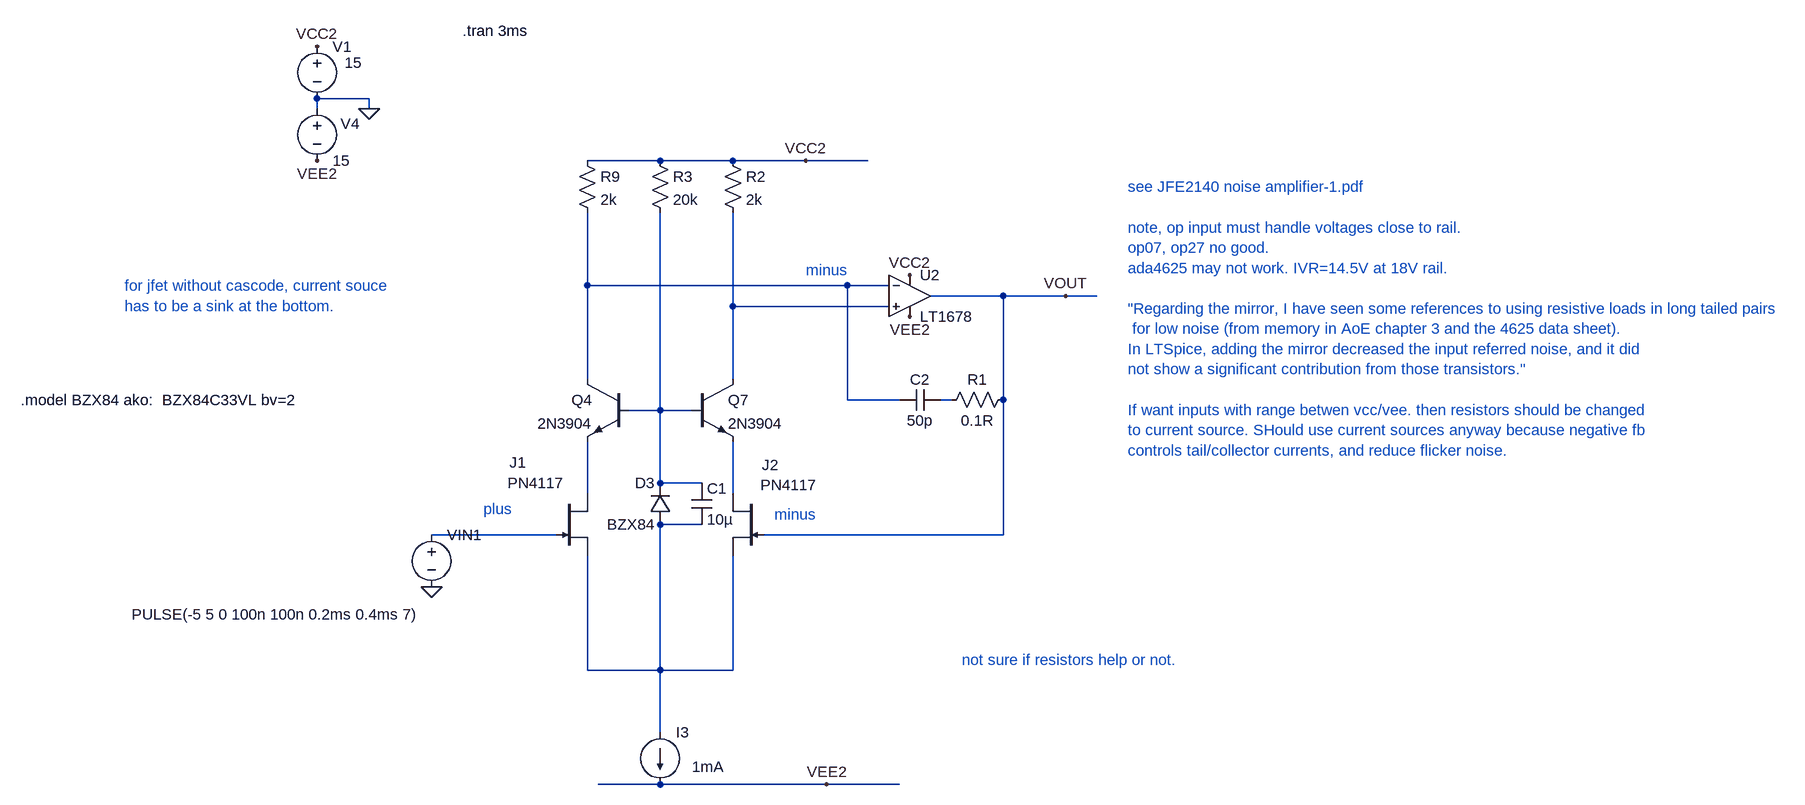
[diagram p0: schematic Draft48.asc]
Draft48.asc, the LTspice schematic file:
Version 4
SHEET 1 2428 952
WIRE -256 -288 -336 -288
WIRE -336 -272 -336 -288
WIRE -256 -272 -256 -288
WIRE 192 -192 80 -192
WIRE 304 -192 192 -192
WIRE 416 -192 304 -192
WIRE 512 -192 416 -192
WIRE 80 0 80 -112
WIRE 480 0 80 0
WIRE 544 0 480 0
WIRE 720 16 608 16
WIRE 816 16 720 16
WIRE 864 16 816 16
WIRE 304 32 304 -112
WIRE 544 32 304 32
WIRE 80 144 80 0
WIRE 304 144 304 32
WIRE 480 176 480 0
WIRE 560 176 480 176
WIRE 640 176 624 176
WIRE 720 176 720 16
WIRE 192 192 192 -112
WIRE 192 192 144 192
WIRE 240 192 192 192
WIRE 192 304 192 192
WIRE 256 304 192 304
WIRE 80 320 80 240
WIRE 304 320 304 240
WIRE 256 368 192 368
WIRE 32 384 -160 384
WIRE 720 384 720 176
WIRE 720 384 352 384
WIRE 80 592 80 416
WIRE 192 592 192 368
WIRE 192 592 80 592
WIRE 304 592 304 416
WIRE 304 592 192 592
WIRE 192 688 192 592
WIRE 192 768 96 768
WIRE 448 768 192 768
WIRE 560 768 448 768
FLAG -256 -272 0
FLAG -336 -368 VCC2
FLAG -336 -192 VEE2
FLAG 416 -192 VCC2
FLAG 448 768 VEE2
FLAG -160 464 0
FLAG 816 16 VOUT
FLAG 576 -16 VCC2
FLAG 576 48 VEE2
SYMBOL voltage -336 -384 R0
WINDOW 123 0 0 Left 0
WINDOW 39 0 0 Left 0
WINDOW 3 42 41 Left 2
SYMATTR Value 15
SYMATTR InstName V1
SYMBOL voltage -336 -288 R0
WINDOW 123 0 0 Left 0
WINDOW 39 0 0 Left 0
WINDOW 0 36 39 Left 2
SYMATTR InstName V4
SYMATTR Value 15
SYMBOL voltage -160 368 R0
WINDOW 123 0 0 Left 0
WINDOW 39 0 0 Left 0
WINDOW 3 -461 138 Left 2
SYMATTR Value PULSE(-5 5 0 100n 100n 0.2ms 0.4ms 7)
SYMATTR InstName VIN1
SYMBOL res 64 -208 R0
SYMATTR InstName R9
SYMATTR Value 2k
SYMBOL njf 32 320 R0
WINDOW 0 -72 -48 Left 2
WINDOW 3 -75 -16 Left 2
SYMATTR InstName J1
SYMATTR Value PN4117
SYMBOL njf 352 320 M0
WINDOW 0 3 -44 Right 2
WINDOW 3 6 -13 Right 2
SYMATTR InstName J2
SYMATTR Value PN4117
SYMBOL current 192 688 R0
WINDOW 123 0 0 Left 0
WINDOW 39 0 0 Left 0
WINDOW 3 49 53 Left 2
SYMATTR Value 1mA
SYMATTR InstName I3
SYMBOL res 288 -208 R0
SYMATTR InstName R2
SYMATTR Value 2k
SYMBOL npn 144 144 M0
SYMATTR InstName Q4
SYMATTR Value 2N3904
SYMBOL npn 240 144 R0
SYMATTR InstName Q7
SYMATTR Value 2N3904
SYMBOL diode 208 368 R180
WINDOW 0 24 64 Left 2
WINDOW 3 24 0 Left 2
SYMATTR InstName D3
SYMATTR Value BZX84
SYMBOL cap 240 304 R0
SYMATTR InstName C1
SYMATTR Value 10µ
SYMBOL cap 624 160 R90
WINDOW 0 0 32 VBottom 2
WINDOW 3 32 32 VTop 2
SYMATTR InstName C2
SYMATTR Value 50p
SYMBOL OpAmps\\LT1678 576 16 R0
SYMATTR InstName U2
SYMBOL res 736 160 R90
WINDOW 0 0 56 VBottom 2
WINDOW 3 32 56 VTop 2
SYMATTR InstName R1
SYMATTR Value 0.1R
SYMBOL res 176 -208 R0
SYMATTR InstName R3
SYMATTR Value 20k
TEXT -112 -392 Left 2 !.tran 3ms
TEXT 368 352 Left 2 ;minus
TEXT -632 0 Left 2 ;for jfet without cascode, current souce \nhas to be a sink at the bottom.
TEXT -80 344 Left 2 ;plus
TEXT -792 176 Left 2 !.model BZX84 ako:  BZX84C33VL bv=2
TEXT 416 -24 Left 2 ;minus
TEXT 912 -152 Left 2 ;see JFE2140 noise amplifier-1.pdf\n \nnote, op input must handle voltages close to rail.\nop07, op27 no good.\nada4625 may not work. IVR=14.5V at 18V rail.\n \n"Regarding the mirror, I have seen some references to using resistive loads in long tailed pairs\n for low noise (from memory in AoE chapter 3 and the 4625 data sheet).  \nIn LTSpice, adding the mirror decreased the input referred noise, and it did \nnot show a significant contribution from those transistors."\n \nIf want inputs with range betwen vcc/vee. then resistors should be changed\nto current source. SHould use current sources anyway because negative fb\ncontrols tail/collector currents, and reduce flicker noise.
TEXT 656 576 Left 2 ;not sure if resistors help or not.

The netlist it stands for:
* Draft48.asc
V1 VCC2 0 15
V4 0 VEE2 15
VIN1 N008 0 PULSE(-5 5 0 100n 100n 0.2ms 0.4ms 7)
R9 VCC2 N001 2k
J1 N005 N008 N007 PN4117
J2 N006 VOUT N007 PN4117
I3 N007 VEE2 1mA
R2 VCC2 N002 2k
Q4 N001 N004 N005 0 2N3904
Q7 N002 N004 N006 0 2N3904
D3 N007 N004 BZX84
C1 N004 N007 10µ
C2 N003 N001 50p
XU2 N002 N001 VOUT VCC2 VEE2 LT1678  ; pins In+ In- OUT V+ V-
R1 VOUT N003 0.1R
R3 VCC2 N004 20k
.model D D
.lib standard.dio
.model NPN NPN
.model PNP PNP
.lib standard.bjt
.model NJF NJF
.model PJF PJF
.lib standard.jft
.tran 3ms
* minus
* for jfet without cascode, current souce
* has to be a sink at the bottom.
* plus
.model BZX84 ako:  BZX84C33VL bv=2
* minus
* see JFE2140 noise amplifier-1.pdf
* note, op input must handle voltages close to rail.
* op07, op27 no good.
* ada4625 may not work. IVR=14.5V at 18V rail.
* "Regarding the mirror, I have seen some references to using resistive loads in long tailed pairs
*  for low noise (from memory in AoE chapter 3 and the 4625 data sheet).
* In LTSpice, adding the mirror decreased the input referred noise, and it did
* not show a significant contribution from those transistors."
* If want inputs with range betwen vcc/vee. then resistors should be changed
* to current source. SHould use current sources anyway because negative fb
* controls tail/collector currents, and reduce flicker noise.
* not sure if resistors help or not.
.backanno
.end